# EAGLE schematic ESP8266_SmartHome_Switch (EAGLE 7.6.0)
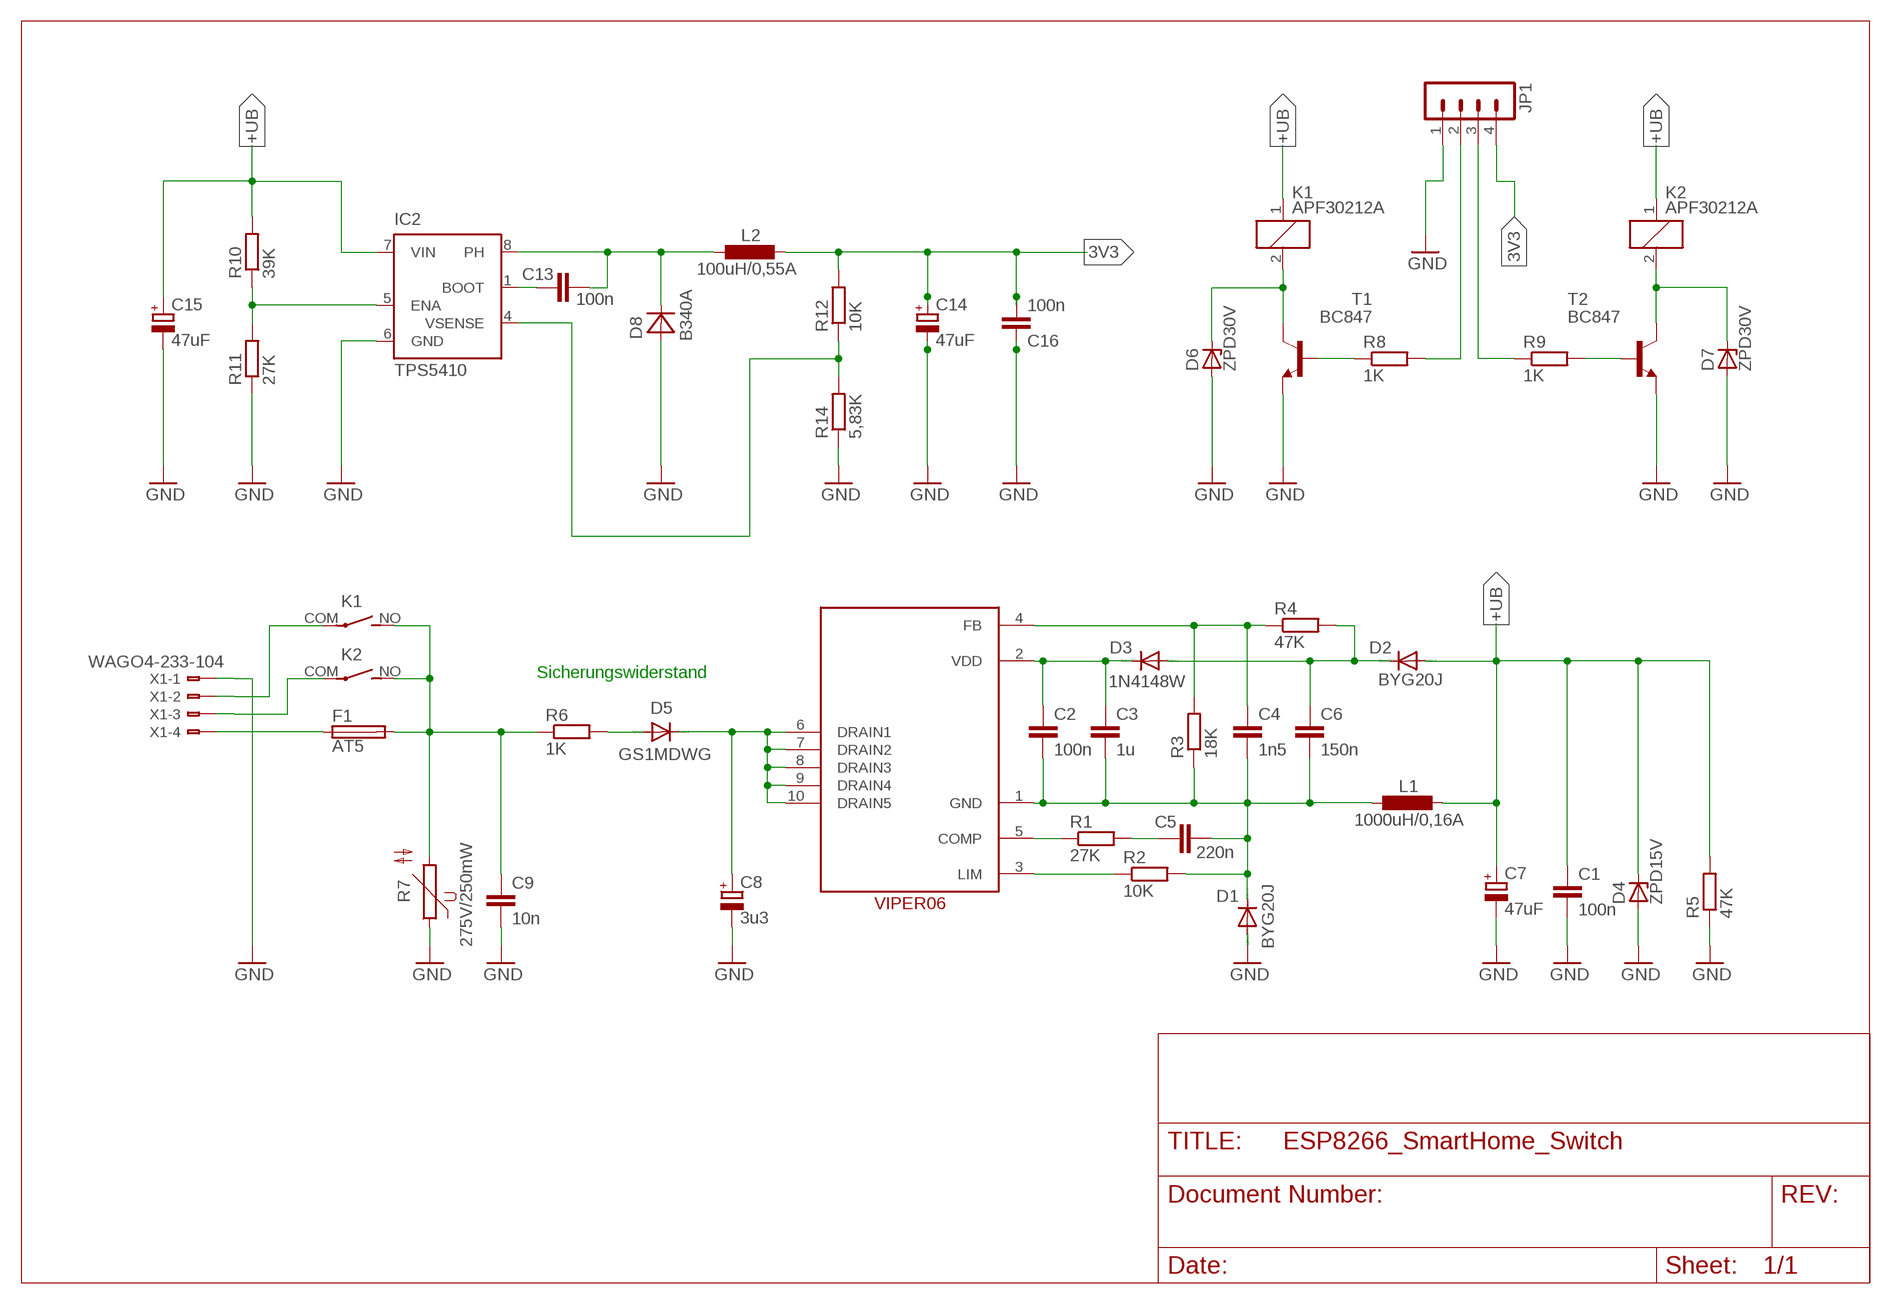
[diagram p0: schematic, sheet 1]

## Parts
C1  100n  C-EUC0603  [C0603]
C2  100n  C-EUC0603  [C0603]
C3  1u  C-EUC0603  [C0603]
C4  1n5  C-EUC0603  [C0603]
C5  220n  C-EUC0603  [C0603]
C6  150n  C-EUC0603  [C0603]
C7  47uF  CPOL-EUD/7343-31W  [D/7343-31W]
C8  3u3  CPOL-EUE5-10.5  [E5-10,5]
C9  10n  C7.5/4  [C7.5B4]
C13  100n  C-EUC0603  [C0603]
C14  47uF  CPOL-EUD/7343-31W  [D/7343-31W]
C15  47uF  CPOL-EUD/7343-31W  [D/7343-31W]
C16  100n  C-EUC0603  [C0603]
D1  BYG20J  DIODE-DO-214AC  [DO-214AC]
D2  BYG20J  DIODE-DO-214AC  [DO-214AC]
D3  1N4148W  CGRM4001-G  [SOD-123_MINI-SMA]
D4  ZPD15V  ZENER-DIODESMB  [SMB]
D5  GS1MDWG  DIODE-DO214AC  [DO214AC]
D6  ZPD30V  ZENER-DIODESMB  [SMB]
D7  ZPD30V  ZENER-DIODESMB  [SMB]
D8  B340A  MBRA340T3  [SMA]
F1  AT5  TR5  [TR5]
IC1  VIPER06HS  [SSO10]
IC2  TPS5410  [D_R-PDSO-G08]
JP1  MA04-1  [MA04-1]
K1  APF30212A  [APF30212A]
K2  APF30212A  [APF30212A]
L1  1000uH/0,16A  L-EUWE-TPC  [POWER-CHOKE_WE-TPC]
L2  100uH/0,55A  L-EUWE-TPC  [POWER-CHOKE_WE-TPC]
R1  27K  R-EU_R0603  [R0603]
R2  10K  R-EU_R0603  [R0603]
R3  18K  R-EU_R0603  [R0603]
R4  47K  R-EU_R0603  [R0603]
R5  47K  R-EU_R0603  [R0603]
R6  1K  R-EU_0414/5V  [0414V]
R7  275V/250mW  S07K275  [S07K275]
R8  1K  R-EU_R0603  [R0603]
R9  1K  R-EU_R0603  [R0603]
R10  39K  R-EU_R0603  [R0603]
R11  27K  R-EU_R0603  [R0603]
R12  10K  R-EU_R0603  [R0603]
R14  5,83K  R-EU_R0603  [R0603]
T1  BC847  [SOT23]
T2  BC847  [SOT23]
X1  WAGO4-233-104  [233-104]

## Nets
3V3: C14.+ C16.2 JP1.4 L2.1 R12.2
+UB: C1.1 C7.+ C15.+ D2.A D4.C IC2.7(VIN) K1.1 K2.1 L1.1 R5.2 R10.2
GND: C1.2 C7.- C8.- C9.2 C14.- C15.- C16.1 D1.A D4.A D6.A D7.A D8.A IC2.6(GND) JP1.1 R5.1 R7.1 R11.1 R14.1 T1.2(E) T2.2(E) X1.A1(-1:A1) X1.B1(-1:B1)
N$1: IC1.3(LIM) R2.1
N$2: IC1.5(COMP) R1.1
N$3: C5.1 R1.2
N$4: C2.2 C3.2 C4.2 C5.2 C6.2 D1.C IC1.1(GND) L1.2 R2.2 R3.1
N$5: C2.1 C3.1 D3.C IC1.2(VDD)
N$6: C4.1 IC1.4(FB) R3.2 R4.1
N$7: C6.1 D2.C D3.A R4.2
N$8: C8.+ D5.C IC1.6(DRAIN1) IC1.7(DRAIN2) IC1.8(DRAIN3) IC1.9(DRAIN4) IC1.10(DRAIN5)
N$9: D5.A R6.2
N$10: C9.1 F1.2 K1.NO(2:S) K2.NO(2:S) R6.1 R7.2
N$11: D6.C K1.2 T1.3(C)
N$12: K1.COM(2:P) X1.A2(-2:A1) X1.B2(-2:B1)
N$13: K2.COM(2:P) X1.A3(-3:A1) X1.B3(-3:B1)
N$14: F1.1 X1.A4(-4:A1) X1.B4(-4:B1)
N$15: JP1.2 R8.2
N$16: D7.C K2.2 T2.3(C)
N$17: R9.2 T2.1(B)
N$18: JP1.3 R9.1
N$19: R8.1 T1.1(B)
N$20: IC2.5(ENA) R10.1 R11.2
N$21: C13.1 IC2.1(BOOT)
N$22: C13.2 D8.C IC2.8(PH) L2.2
N$24: IC2.4(VSENSE) R12.1 R14.2

## Notes on the sheet
- Sicherungswiderstand

## Library data of the parts
C1-C3 C5 C6 C13 C16 = resistor:C-EU: CAPACITOR, European symbol; VOLTAGE: 50V
C4 = resistor:C-EU: CAPACITOR, European symbol; VOLTAGE: 25V
C7 C14 C15 = rcl:CPOL-EU: POLARIZED CAPACITOR, European symbol; PARTNUMBER: T495X476K035ATE200; VOLTAGE: 35V
C8 = rcl:CPOL-EU: POLARIZED CAPACITOR, European symbol; MANUFACTURER: Wurth; PARTNUMBER: 860021375007; VOTALGE: 400V
C9 = capacitor-wima:C: CAPACITOR naming: grid - package width; PARTNUMBER: MKP-X2 10N
D1 D2 D5 = diode:DIODE-: DIODE
D3 = diode:CGRM400*-G: Molded plasitc,JEDEC SOD-123/Mini SMA Source: Comchip CGRM4001-G.pdf
D4 D6 D7 = diode:ZENER-DIODE: Z-Diode
D8 = diode:MBRA340T3: Surface Mount Schottky Power Rectifier Source: http://www.onsemi.com/pub_link/Collateral/MBRA340T3-D.PDF
F1 = fuse:TR5: FUSE Wickmann; OC_FARNELL: unknown; OC_NEWARK: unknown; OC_REICHELT: MIK-TR 5.0A
IC1 = SmartHome_Switch_Parts:VIPER06HS
IC2 = texas:TPS5410: 1-A, WIDE INPUT RANGE, STEP-DOWN SWIFT? CONVERTER Source: U7 Texas TPS5410 Step Down Converter.pdf; MPN: TPS5410DR; OC_FARNELL: 1329596; OC_NEWARK: 18M3223
JP1 = con-lstb:MA04-1: PIN HEADER; OC_FARNELL: unknown; OC_NEWARK: unknown
K1 K2 = relay:APF30212A: Compliant with European standards 1a/1c 6A Slim power relays Source: Data sheet <http://pewa.panasonic.com/assets/pcsd/catalog/pf-catalog.pdf>; OC_FARNELL: unknown
L1 = resistor:L-EU: INDUCTOR, European symbol; PARTNUMBER: 744062102
L2 = resistor:L-EU: INDUCTOR, European symbol; PARTNUMBER: 744062101
R1-R5 R8-R12 R14 = resistor:R-EU_: RESISTOR, European symbol
R6 = rcl:R-EU_: RESISTOR, European symbol; POWER: 0.5W
R7 = varistor:S07K275: VARISTOR
T1 T2 = transistor:BC847: NPN TRANSISTOR
X1 = con-wago:WAGO4-: WAGO Cage Clamp; MPN: 233-104; OC_FARNELL: unknown; OC_NEWARK: 28K9046